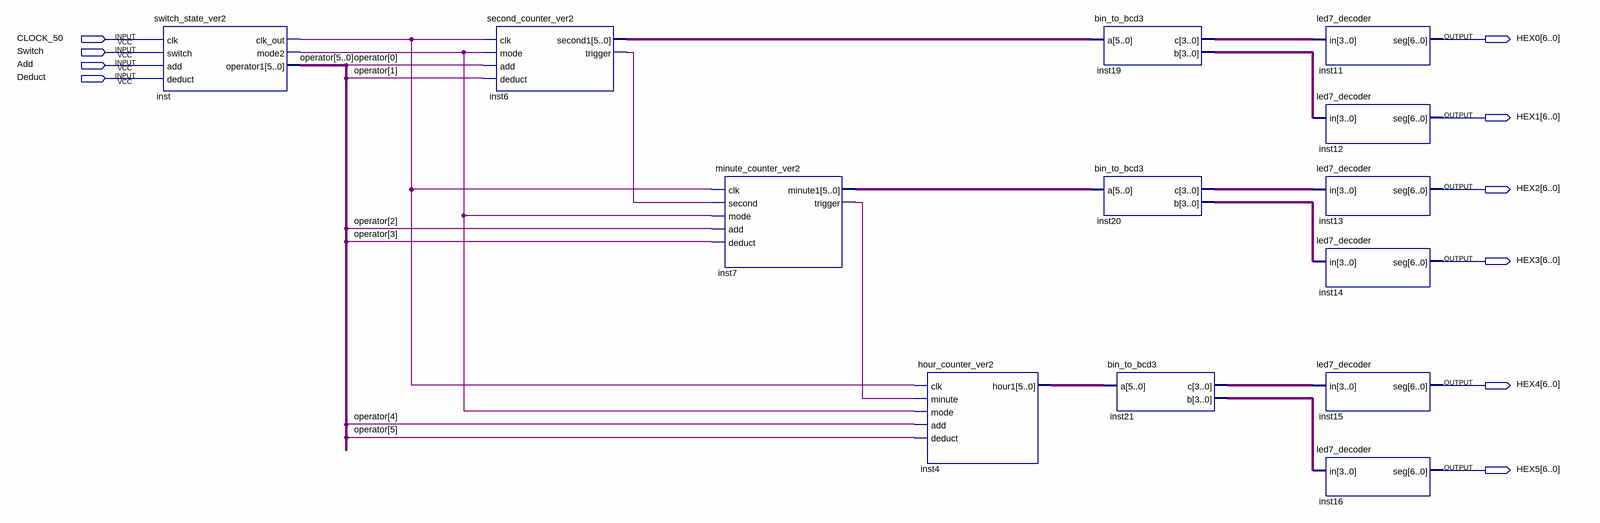
[diagram p0: schematic sheet]
// Quartus schematic mini_block_diagram.bdf as structural Verilog: 13 symbols, 10 pins
module mini_block_diagram (
  input  CLOCK_50,
  input  Switch,
  input  Add,
  input  Deduct,
  output [6:0] HEX0,
  output [6:0] HEX1,
  output [6:0] HEX2,
  output [6:0] HEX3,
  output [6:0] HEX4,
  output [6:0] HEX5
);

  wire inst6_trigger, inst7_trigger, inst_clk_out, inst_mode2;
  wire [3:0] inst19_b, inst19_c, inst20_b, inst20_c, inst21_b, inst21_c;
  wire [5:0] inst4_hour1, inst6_second1, inst7_minute1, operator;

  switch_state_ver2 inst (
    .clk(CLOCK_50), .switch(Switch), .add(Add), .deduct(Deduct), .clk_out(inst_clk_out), .mode2(inst_mode2),
    .operator1(operator));
  second_counter_ver2 inst6 (
    .clk(inst_clk_out), .mode(inst_mode2), .add(operator[0]), .deduct(operator[1]), .second1(inst6_second1),
    .trigger(inst6_trigger));
  minute_counter_ver2 inst7 (
    .clk(inst_clk_out), .second(inst6_trigger), .mode(inst_mode2), .add(operator[2]), .deduct(operator[3]),
    .minute1(inst7_minute1), .trigger(inst7_trigger));
  hour_counter_ver2 inst4 (
    .clk(inst_clk_out), .minute(inst7_trigger), .mode(inst_mode2), .add(operator[4]), .deduct(operator[5]),
    .hour1(inst4_hour1));
  bin_to_bcd3 inst19 (.a(inst6_second1), .c(inst19_c), .b(inst19_b));
  bin_to_bcd3 inst20 (.a(inst7_minute1), .c(inst20_c), .b(inst20_b));
  bin_to_bcd3 inst21 (.a(inst4_hour1), .c(inst21_c), .b(inst21_b));
  led7_decoder inst11 (.in(inst19_c), .seg(HEX0));
  led7_decoder inst12 (.in(inst19_b), .seg(HEX1));
  led7_decoder inst13 (.in(inst20_c), .seg(HEX2));
  led7_decoder inst14 (.in(inst20_b), .seg(HEX3));
  led7_decoder inst15 (.in(inst21_c), .seg(HEX4));
  led7_decoder inst16 (.in(inst21_b), .seg(HEX5));
endmodule
